# Altium schematic sheet [2]-Power Budget.SchDoc: Mixed Signal Board
size A4; Author: AVIRAL MISHRA; DocumentNumber: 2; SheetNumber: 2; SheetTotal: 11; PROJECT CODE: A_V1.0
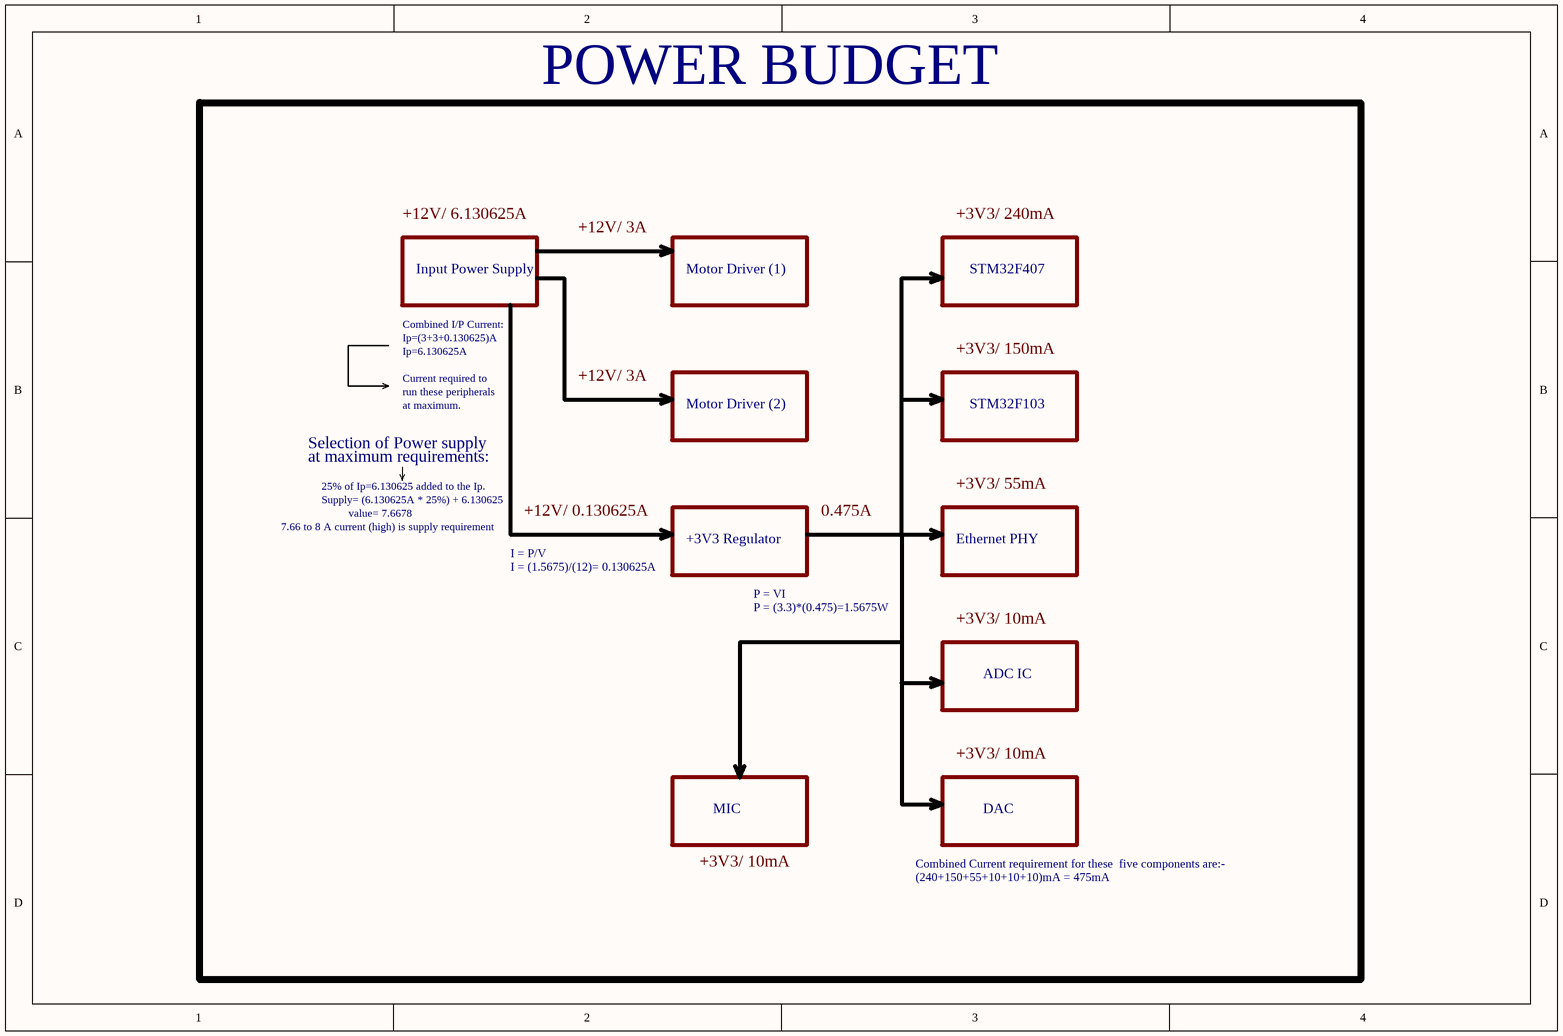
[diagram p0: [2]-Power Budget.SchDoc]

## Notes on the sheet
- POWER BUDGET
- +12V/ 6.130625A
- +12V/ 3A
- +3V3/ 240mA
- Input Power Supply
- Motor Driver (1)
- STM32F407
- Ip=(3+3+0.130625)A
- Combined I/P Current:
- Ip=6.130625A
- Current required to
- +3V3/ 150mA
- Selection of Power supply
- run these peripherals
- at maximum.
- Motor Driver (2)
- STM32F103
- at maximum requirements:
- 25% of Ip=6.130625 added to the Ip.
- Supply= (6.130625A * 25%) + 6.130625
- value= 7.6678
- +12V/ 0.130625A
- 0.475A
- +3V3/ 55mA
- 7.66 to 8 A current (high) is supply requirement
- I = P/V
- I = (1.5675)/(12)= 0.130625A
- +3V3 Regulator
- Ethernet PHY
- P = VI
- P = (3.3)*(0.475)=1.5675W
- +3V3/ 10mA
- ADC IC
- MIC
- DAC
- Combined Current requirement for these  five components are:-
- (240+150+55+10+10+10)mA = 475mA
- TITLE:
- DOCUMENT NAME:
- SCALE 1:1
- This document is copyright of EsteemPCB and shall not be revealed, produced, copied, in whole or in part, nor
- PROJECT CODE:
- TEMPLATE:
- A4
- AUTHOR:
- Sheet
- of
- used for any purpose other than submitted.